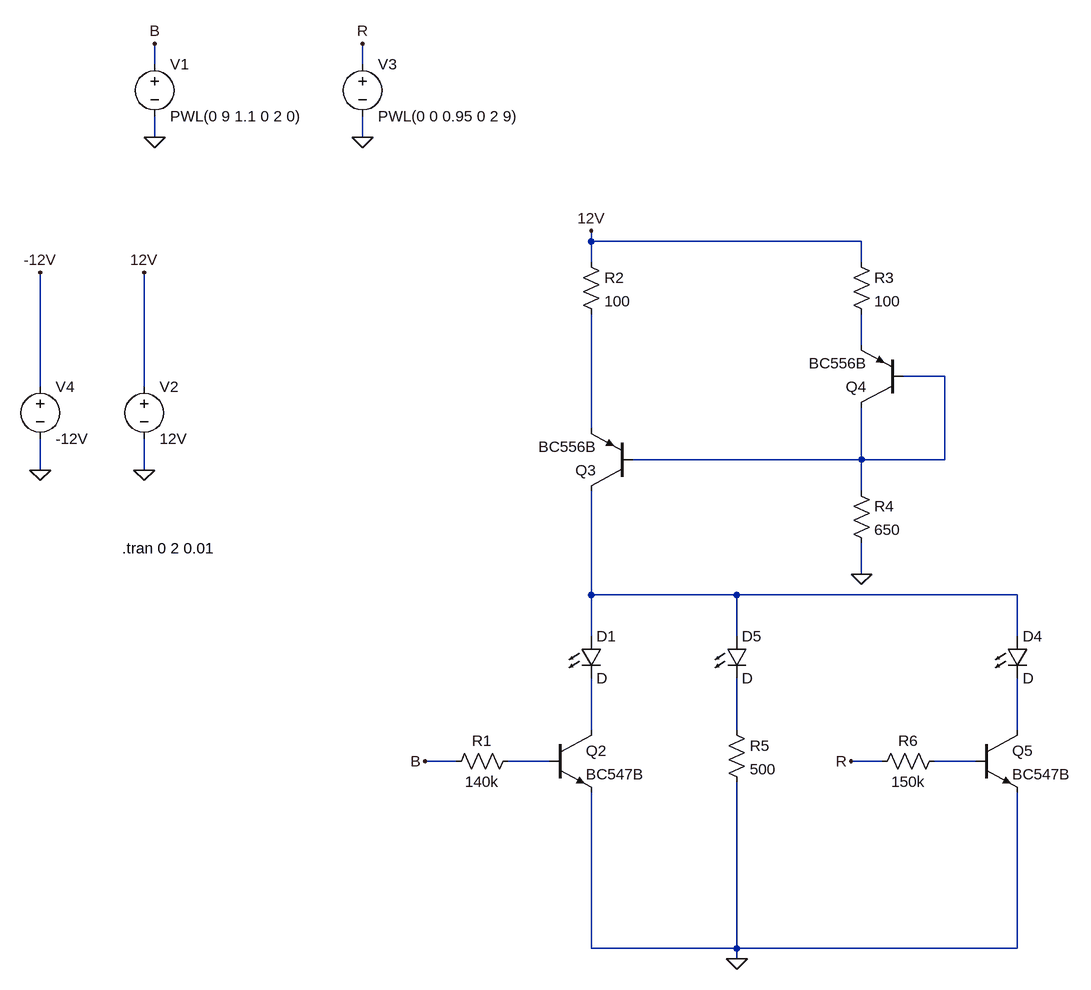
[diagram p0: schematic display unit current mirror.asc]
display unit current mirror.asc, the LTspice schematic file:
Version 4
SHEET 1 1676 820
WIRE 176 -640 176 -672
WIRE 496 -640 496 -672
WIRE 176 -528 176 -560
WIRE 496 -528 496 -560
WIRE 848 -368 848 -384
WIRE 1264 -368 848 -368
WIRE 848 -336 848 -368
WIRE 1264 -336 1264 -368
WIRE 1264 -208 1264 -256
WIRE 1392 -160 1328 -160
WIRE 0 -144 0 -320
WIRE 160 -144 160 -320
WIRE 848 -80 848 -256
WIRE 1264 -32 1264 -112
WIRE 1264 -32 912 -32
WIRE 1392 -32 1392 -160
WIRE 1392 -32 1264 -32
WIRE 0 -16 0 -64
WIRE 160 -16 160 -64
WIRE 1264 16 1264 -32
WIRE 1264 144 1264 96
WIRE 848 176 848 16
WIRE 1072 176 848 176
WIRE 1504 176 1072 176
WIRE 848 240 848 176
WIRE 1072 240 1072 176
WIRE 1504 240 1504 176
WIRE 848 384 848 304
WIRE 1072 384 1072 304
WIRE 1504 384 1504 304
WIRE 640 432 592 432
WIRE 784 432 720 432
WIRE 1296 432 1248 432
WIRE 1440 432 1376 432
WIRE 848 720 848 480
WIRE 1072 720 1072 464
WIRE 1072 720 848 720
WIRE 1504 720 1504 480
WIRE 1504 720 1072 720
WIRE 1072 736 1072 720
FLAG 160 -16 0
FLAG 160 -320 12V
FLAG 176 -528 0
FLAG 176 -672 B
FLAG 0 -16 0
FLAG 0 -320 -12V
FLAG 848 -384 12V
FLAG 496 -528 0
FLAG 496 -672 R
FLAG 592 432 B
FLAG 1264 144 0
FLAG 1072 736 0
FLAG 1248 432 R
SYMBOL voltage 160 -160 R0
WINDOW 123 0 0 Left 0
WINDOW 39 0 0 Left 0
SYMATTR InstName V2
SYMATTR Value 12V
SYMBOL voltage 176 -656 R0
WINDOW 123 0 0 Left 0
WINDOW 39 0 0 Left 0
SYMATTR InstName V1
SYMATTR Value PWL(0 9 1.1 0 2 0)
SYMBOL voltage 0 -160 R0
WINDOW 123 0 0 Left 0
WINDOW 39 0 0 Left 0
SYMATTR InstName V4
SYMATTR Value -12V
SYMBOL pnp 912 16 R180
SYMATTR InstName Q3
SYMATTR Value BC556B
SYMBOL pnp 1328 -112 R180
SYMATTR InstName Q4
SYMATTR Value BC556B
SYMBOL LED 832 240 R0
SYMATTR InstName D1
SYMBOL npn 784 384 R0
SYMATTR InstName Q2
SYMATTR Value BC547B
SYMBOL res 736 416 R90
WINDOW 0 0 56 VBottom 2
WINDOW 3 32 56 VTop 2
SYMATTR InstName R1
SYMATTR Value 140k
SYMBOL voltage 496 -656 R0
WINDOW 123 0 0 Left 0
WINDOW 39 0 0 Left 0
SYMATTR InstName V3
SYMATTR Value PWL(0 0 0.95 0 2 9)
SYMBOL res 832 -352 R0
SYMATTR InstName R2
SYMATTR Value 100
SYMBOL res 1248 -352 R0
SYMATTR InstName R3
SYMATTR Value 100
SYMBOL res 1248 0 R0
SYMATTR InstName R4
SYMATTR Value 650
SYMBOL res 1056 368 R0
SYMATTR InstName R5
SYMATTR Value 500
SYMBOL npn 1440 384 R0
SYMATTR InstName Q5
SYMATTR Value BC547B
SYMBOL res 1392 416 R90
WINDOW 0 0 56 VBottom 2
WINDOW 3 32 56 VTop 2
SYMATTR InstName R6
SYMATTR Value 150k
SYMBOL LED 1488 240 R0
SYMATTR InstName D4
SYMBOL LED 1056 240 R0
SYMATTR InstName D5
TEXT 126 104 Left 2 !.tran 0 2 0.01

The netlist it stands for:
* display unit current mirror.asc
V2 12V 0 12V
V1 B 0 PWL(0 9 1.1 0 2 0)
V4 -12V 0 -12V
Q3 N004 N002 N003 0 BC556B
Q4 N002 N002 N001 0 BC556B
D1 N004 N005 D
Q2 N005 N008 0 0 BC547B
R1 N008 B 140k
V3 R 0 PWL(0 0 0.95 0 2 9)
R2 12V N003 100
R3 12V N001 100
R4 N002 0 650
R5 N006 0 500
Q5 N007 N009 0 0 BC547B
R6 N009 R 150k
D4 N004 N007 D
D5 N004 N006 D
.model D D
.lib standard.dio
.model NPN NPN
.model PNP PNP
.lib standard.bjt
.tran 0 2 0.01
.backanno
.end